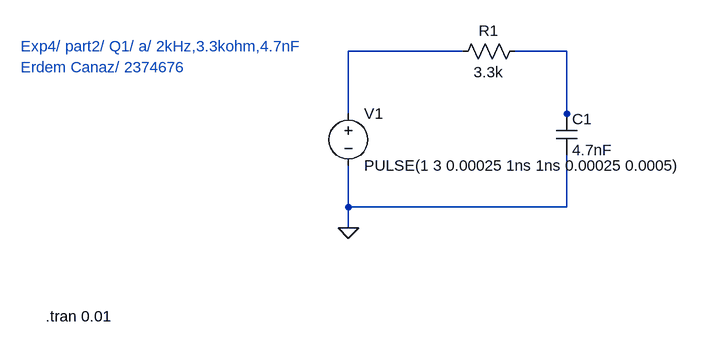
[diagram p0: schematic draft1.asc]
draft1.asc, the LTspice schematic file:
Version 4
SHEET 1 3184 1844
WIRE -1776 -784 -1952 -784
WIRE -1616 -784 -1696 -784
WIRE -1952 -688 -1952 -784
WIRE -1616 -688 -1616 -784
WIRE -1616 -672 -1616 -688
WIRE -1952 -544 -1952 -608
WIRE -1616 -544 -1616 -624
WIRE -1616 -544 -1952 -544
WIRE -1952 -512 -1952 -544
FLAG -1952 -512 0
SYMBOL res -1680 -800 R90
WINDOW 0 0 56 VBottom 2
WINDOW 3 32 56 VTop 2
SYMATTR InstName R1
SYMATTR Value 3.3k
SYMBOL cap -1632 -688 R0
SYMATTR InstName C1
SYMATTR Value 4.7nF
SYMBOL voltage -1952 -704 R0
WINDOW 123 0 0 Left 0
WINDOW 39 0 0 Left 0
SYMATTR InstName V1
SYMATTR Value PULSE(1 3 0.00025 1ns 1ns 0.00025 0.0005)
TEXT -2418 -376 Left 2 !.tran 0.01
TEXT -2456 -792 Left 2 ;Exp4/ part2/ Q1/ a/ 2kHz,3.3kohm,4.7nF
TEXT -2456 -760 Left 2 ;Erdem Canaz/ 2374676

The netlist it stands for:
* draft1.asc
R1 N002 N001 3.3k
C1 N002 0 4.7nF
V1 N001 0 PULSE(1 3 0.00025 1ns 1ns 0.00025 0.0005)
.tran 0.01
* Exp4/ part2/ Q1/ a/ 2kHz,3.3kohm,4.7nF
* Erdem Canaz/ 2374676
.backanno
.end